# EAGLE design 1BUF_1 (EAGLE 6.5.0)

## Sheet 1 of 2
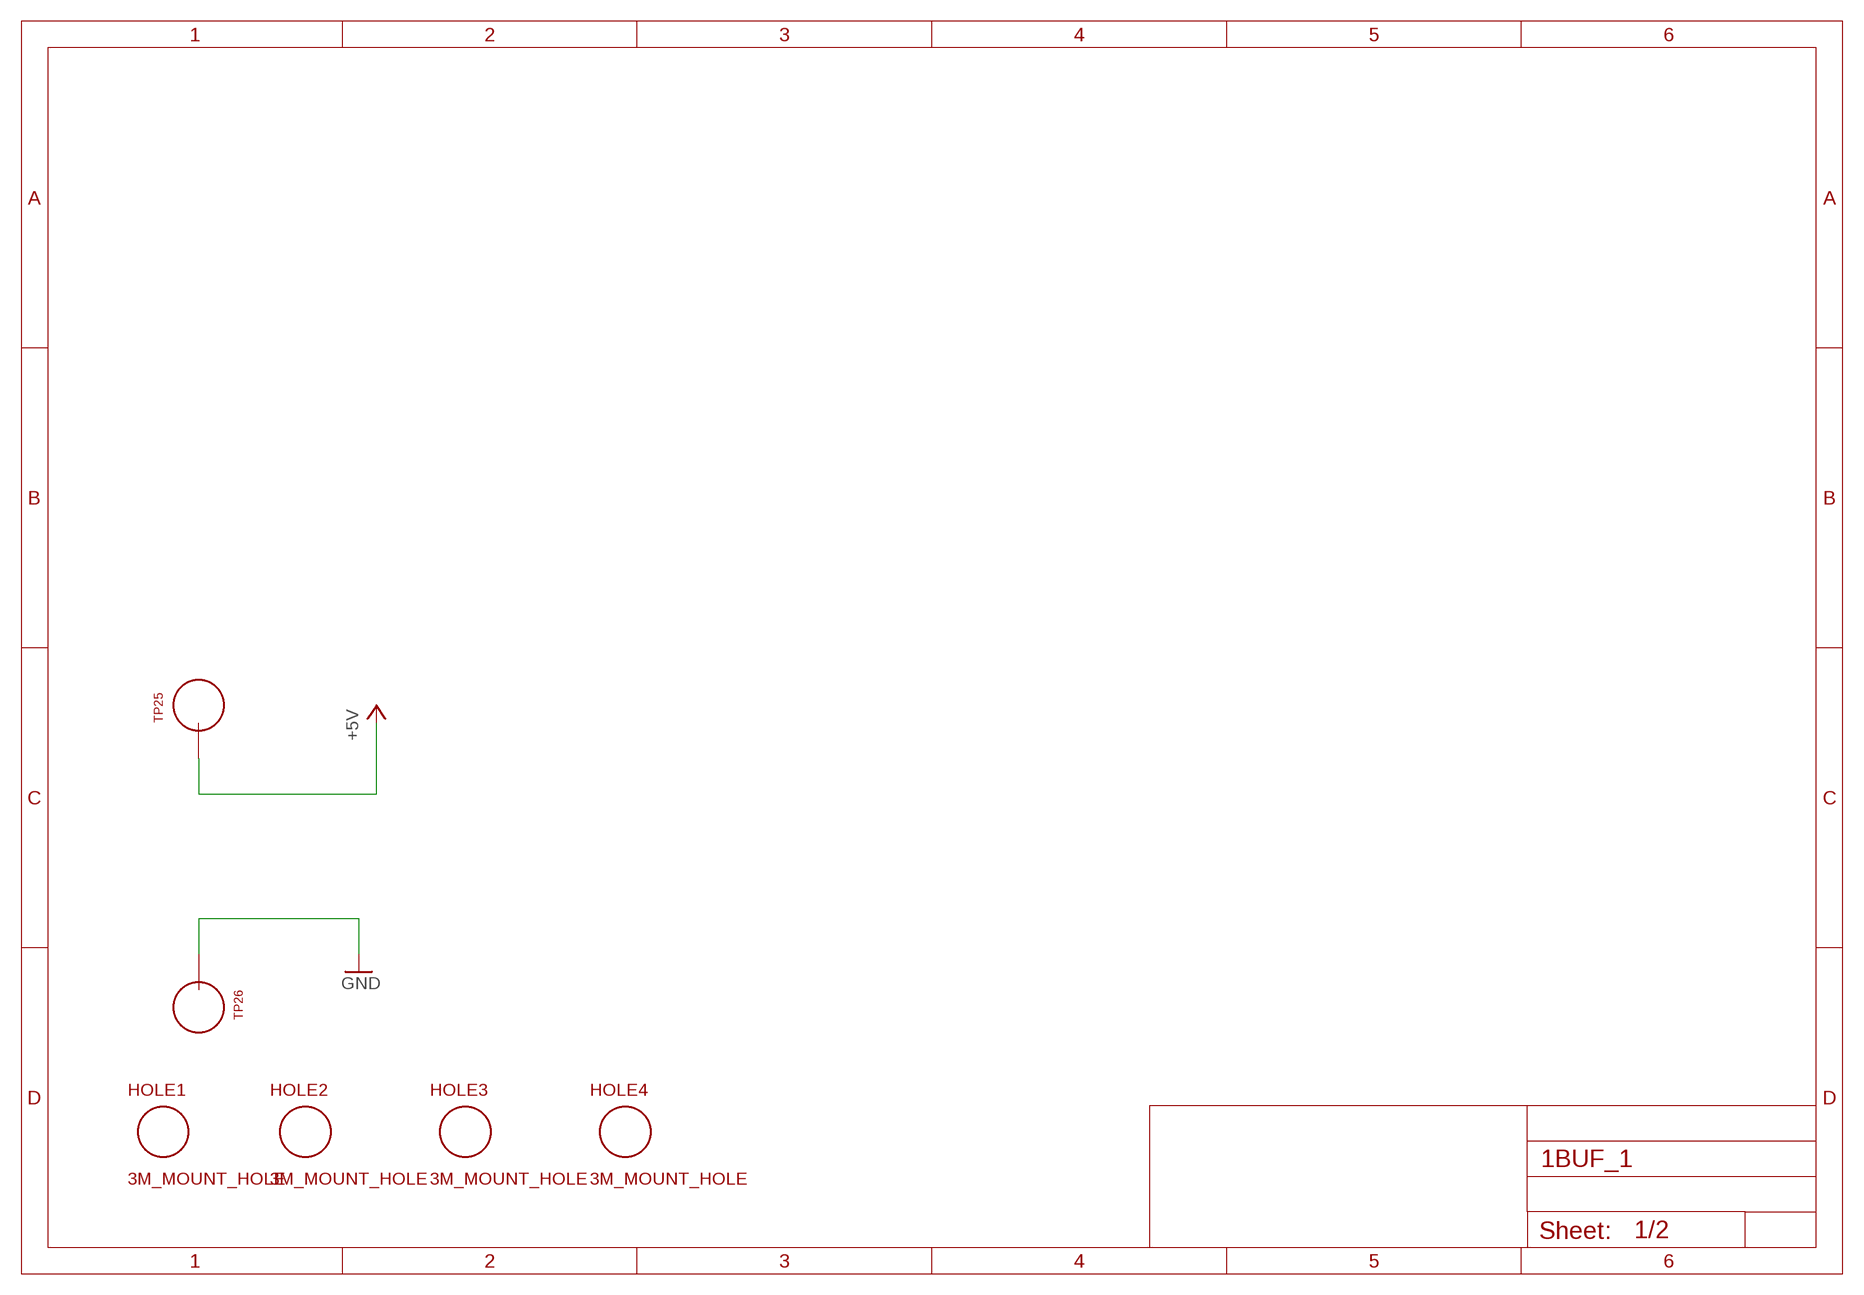
[diagram p0: schematic, sheet 1]

### Parts
HOLE1  3M_MOUNT_HOLE  [3M_HOLE]
HOLE2  3M_MOUNT_HOLE  [3M_HOLE]
HOLE3  3M_MOUNT_HOLE  [3M_HOLE]
HOLE4  3M_MOUNT_HOLE  [3M_HOLE]
TP25  TEST_LOOP  [TEST_LOOP]
TP26  TEST_LOOP  [TEST_LOOP]

### Nets
+5V: TP25.P$1 ; also sheet 2
GND: TP26.P$1 ; also sheet 2

## Sheet 2 of 2
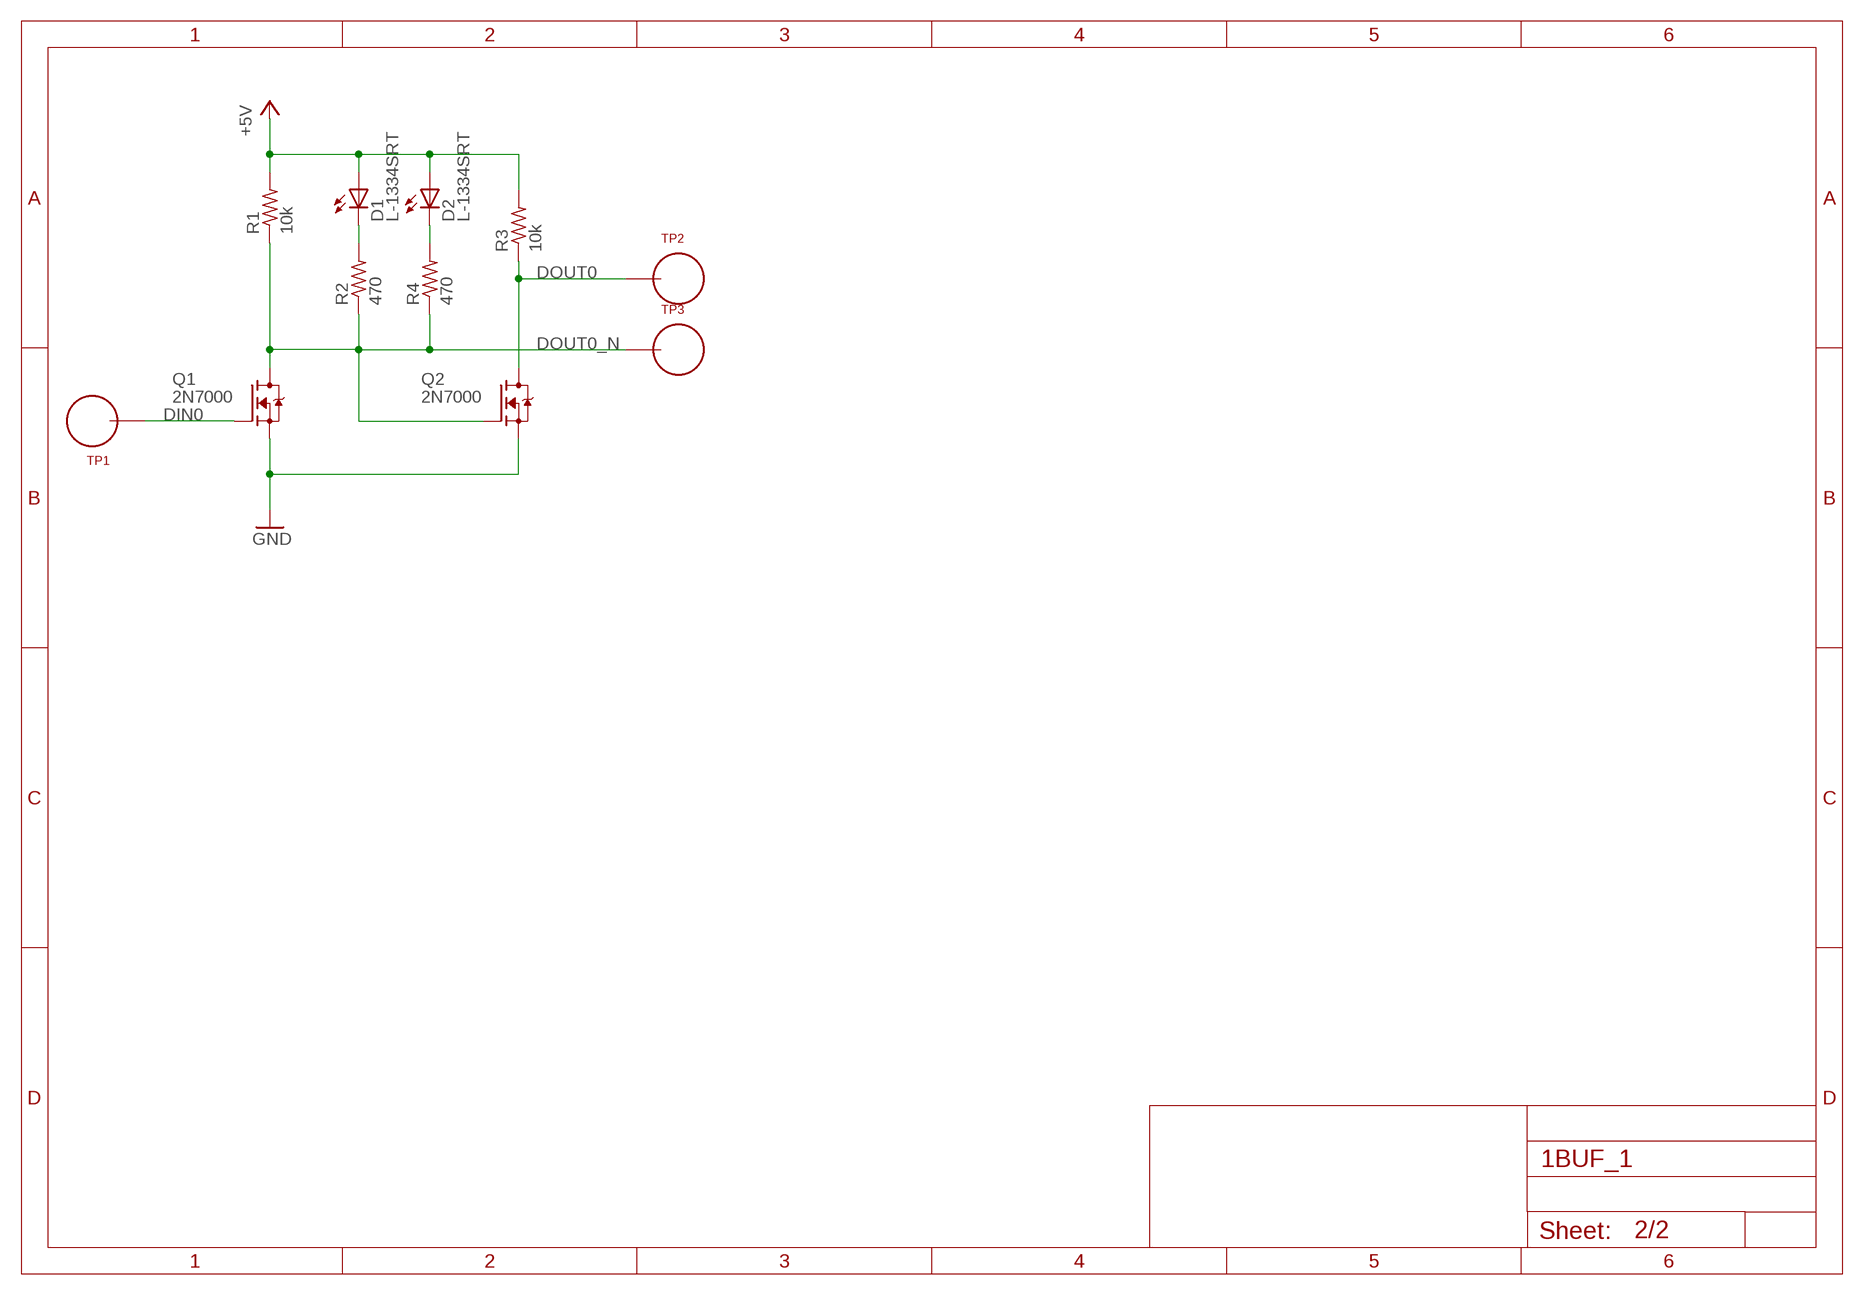
[diagram p1: schematic, sheet 2]

### Parts
D1  L-1334SRT  [LED3MM]
D2  L-1334SRT  [LED3MM]
Q1  2N7000  [TO92-DGS]
Q2  2N7000  [TO92-DGS]
R1  10k  R_P2INCH  [R_P2INCH]
R2  470  R_P2INCH  [R_P2INCH]
R3  10k  R_P2INCH  [R_P2INCH]
R4  470  R_P2INCH  [R_P2INCH]
TP1  TEST_LOOP  [TEST_LOOP]
TP2  TEST_LOOP  [TEST_LOOP]
TP3  TEST_LOOP  [TEST_LOOP]

### Nets
+5V: D1.A D2.A R1.2 R3.2 ; also sheet 1
DIN0: Q1.G TP1.P$1
DOUT0: Q2.D R3.1 TP2.P$1
DOUT0_N: Q1.D Q2.G R1.1 R2.1 R4.1 TP3.P$1
GND: Q1.S Q2.S ; also sheet 1
N$1: D2.K(C) R4.2
N$2: D1.K(C) R2.2

## Library data of the parts
D1 D2 = MyLib:L-1334SRT
HOLE1-HOLE4 = MyLib:3M_MOUNT_HOLE
Q1 Q2 = MyLib:2N7000
R1-R4 = MyLib:R_P2INCH
TP1-TP3 TP25 TP26 = MyLib:TEST_LOOP

## Board
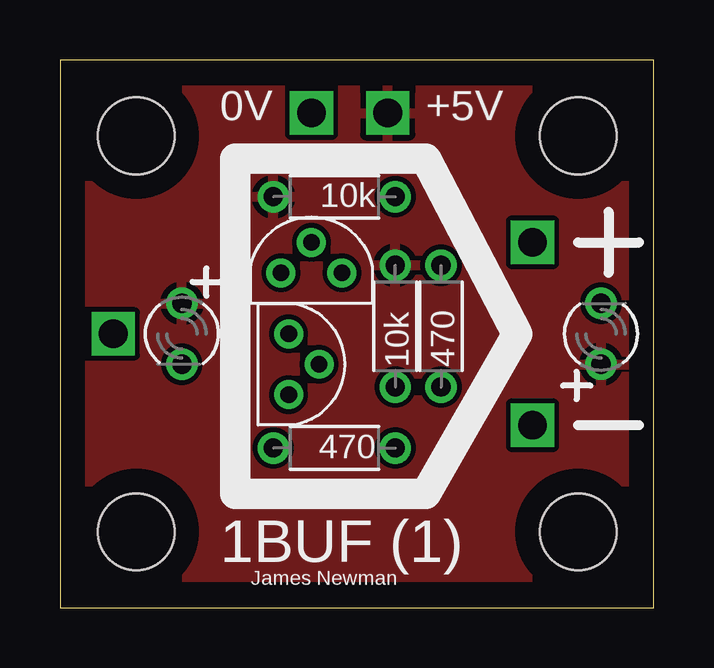
[diagram p2: board, top side]
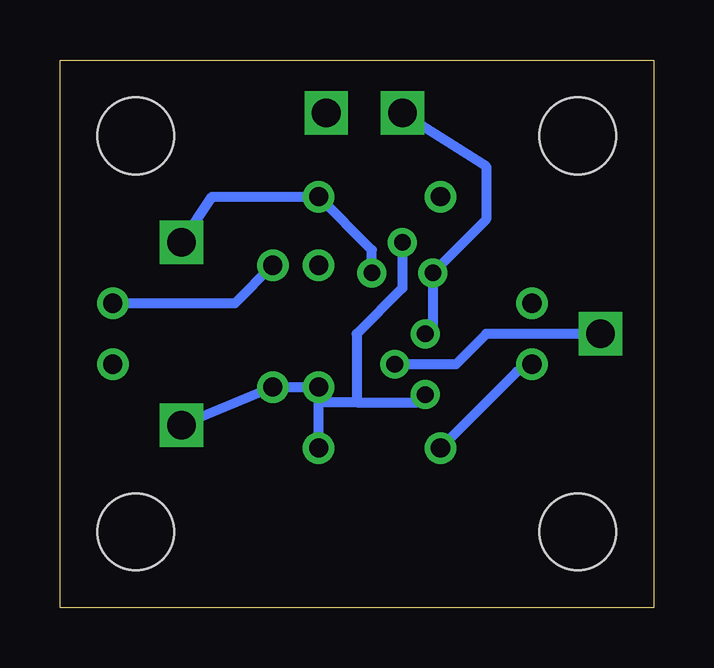
[diagram p3: board, bottom side, seen from below]

Size 24.75 x 22.85 mm. Coordinates in mm from the lower left corner, seen from the top.
Outline: 0,0 24.75,0 24.75,22.85 0,22.85 0,0
Copper layers (1*16): Top 0.035mm / dielectric 1.5mm / Bottom 0.035mm
Design rules "processor_rules_2layer": minimum track width 8mil, minimum drill 14mil, track to track 8mil, track to pad 8mil, pad to pad 8mil, via to via 8mil, smd to smd 8mil, copper to edge 40mil, drill to drill 8mil, minimum pad ring 10mil, minimum via ring 8mil, stop-mask expansion 4mil, vias tented up to drill 0mil, thermal gap 10mil

### Footprints (pad centres in the part's own frame; a part is rotated, then mirrored left to right if it is on the bottom)
LED3MM = drill 0.8: A -1.27,0; K 1.27,0
3M_HOLE = hole 3.2: 0,0
TO92-DGS = drill 0.7: D 0,1.27; G -1.27,0; S 0,-1.27
R_P2INCH = drill 0.8: 1 -2.54,0; 2 2.54,0
TEST_LOOP = drill 1.2 square: P$1 0,0

### Placement (x,y rotation side)
D1  5.08,11.43 270 top
D2  22.54,11.43 90 top
HOLE1  3.17,3.17 0 top
HOLE2  21.59,3.17 0 top
HOLE3  21.59,19.68 0 top
HOLE4  3.17,19.68 0 top
Q1  9.53,10.16 180 top
Q2  10.48,13.97 270 top
R1  13.97,11.75 90 top
R2  11.43,6.67 180 top
R3  11.43,17.14 180 top
R4  15.88,11.75 90 top
TP1  2.22,11.43 0 top
TP2  19.68,15.24 0 top
TP3  19.68,7.62 0 top
TP25  13.65,20.64 0 top
TP26  10.48,20.64 0 top

### Tracks (layer width: path | path; a pad name or v marks a point on that pad's centre or on a via)
+5V
  pour Top: 1.27,1.27 1.27,21.59 23.5,21.59 23.5,1.27
DIN0
  Bottom 0.406: TP1.P$1 6.99,11.43 8.26,10.16 Q1.G
DOUT0
  Bottom 0.406: TP2.P$1 18.41,17.14 R3.1 11.75,14.92 Q2.D
DOUT0_N
  Bottom 0.406: R2.1 13.97,8.57 | 13.97,8.57 R1.1 R4.1 TP3.P$1 | 12.38,8.57 9.84,8.57 Q1.D | Q2.G 10.48,13.34 12.38,11.43 12.38,8.57 | 12.38,8.57 13.97,8.57
GND
  Bottom 0.406: Q1.S 9.21,11.75 Q2.S 6.99,16.19 6.99,18.41 TP26.P$1
N$1
  Bottom 0.406: R4.2 17.46,12.7 D2.K
N$2
  Bottom 0.406: D1.K 5.71,9.84 R2.2

### Text on the board
tPlace: 0V | +5V | 1BUF (1) | James Newman